# Altium schematic sheet IR_BEAT.SchDoc
size A4
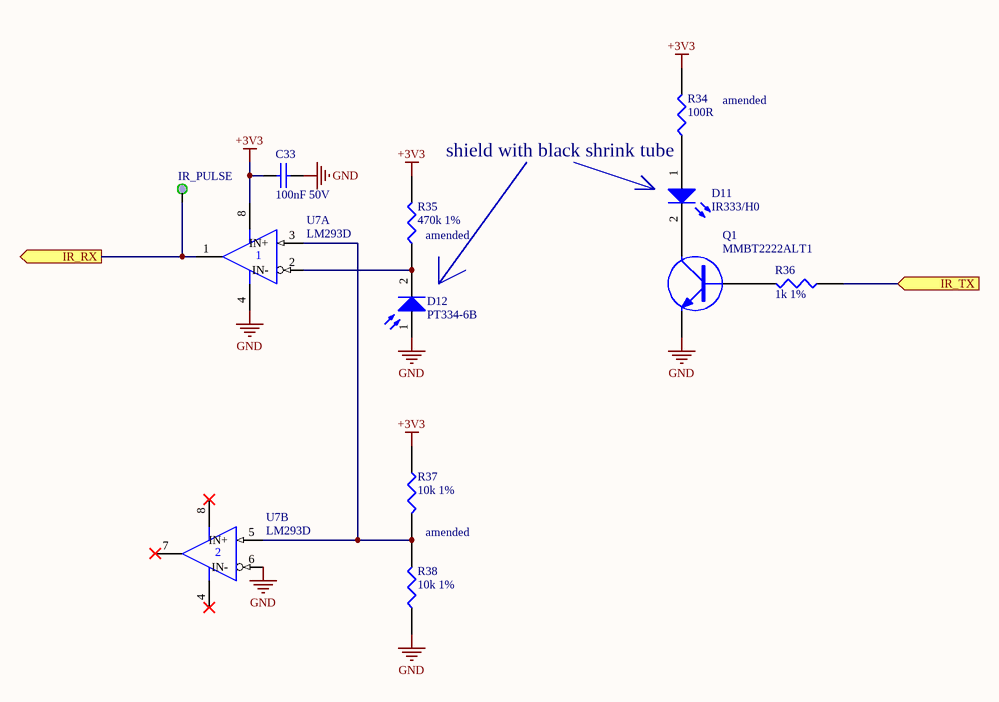
[diagram p0: IR_BEAT.SchDoc]

## Parts
C33  100nF 50V  [CAPC2012N]
D11  IR333/H0  [LED5.08/2.54-2]
D12  PT334-6B  [LED5.08/2.54-2]
IR_PULSE  IR PULSE  [TP1.4/1.0]  (value not drawn)  (no BOM)
Q1  MMBT2222ALT1  [SOT23-3N]
R34  100R  [RESC2012N]
R35  470k 1%  [RESC2012N]
R36  1k 1%  [RESC2012N]
R37  10k 1%  [RESC2012N]
R38  10k 1%  [RESC2012N]
U7  LM293D  [SOP8_M]  (parts A,B of 2)

## Ports
IR_RX (out), IR_TX (in)

## Nets
+3V3: C33.2 R34.2 R35.2 R37.1 U7.8(VCC)
GND: C33.1 D12.1(A) Q1.2(E) R38.1 U7.4(GND) U7.6(IN-)
IR_RX: IR_PULSE.1 U7.1(OUT) ; port IR_RX
IR_TX: R36.1 ; port IR_TX
NetD11_1: D11.1(A) R34.1
NetD11_2: D11.2(K) Q1.3(C)
NetD12_2: D12.2(K) R35.1 U7.2(IN-)
NetQ1_1: Q1.1(B) R36.2
NetR37_2: R37.2 R38.2 U7.3(IN+) U7.5(IN+)

Not connected (* = marked no-connect by the designer): U7 7(OUT)*

## Notes on the sheet
- (near R34) amended
- (near R34) shield with black shrink tube
- (near R35) amended
- amended

## Library data of the parts
C33 = CAP: Capacitor; Price: 0.025
D11 = LED0: Typical INFRARED GaAs LED; Manufacturer: Everlight; Price: *
D12 = Photo Sen: Photosensitive Diode; Manufacturer: Everlight; Price: *
IR_PULSE = TP1.4/1.0
Q1 = MMBT3904: NPN transistor; Price: 0.25
R34-R38 = RES1: Price: 0.0025
U7 = LM393D: Dual Differential Comparator; Published: 15-Apr-2002; LatestRevisionDate: 13-Apr-2006; LatestRevisionNote: IPC-7351 Footprint Added.; DatasheetVersion: Nov-1988; PackageVersion: Jan-1998; PackageReference: D008; Publisher: Altium Limited; PackageDescription: 8-Pin Small Outline Integrated Circuit 1.27 mm Pitch; Code_IPC: SOIC127P600-8; ComponentLink1Description: Manufacturer Link; ComponentLink1URL: http://www.ti.com/; ComponentLink2Description: Datasheet; ComponentLink2URL: http://www-s.ti.com/sc/ds/lm193.pdf; Price: 0.8